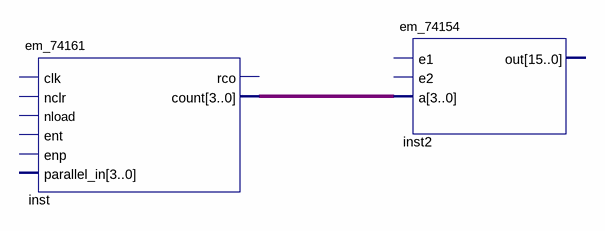
[diagram p0: schematic sheet]
// Quartus schematic E8-T.bdf as structural Verilog: 2 symbols, 0 pins
module \E8-T  (
);

  wire [3:0] inst_count;

  em_74161 inst (.count(inst_count));  // open: clk, nclr, nload, ent, enp, parallel_in, rco
  em_74154 inst2 (.a(inst_count));  // open: e1, e2, out
endmodule
